# Altium project led-cube.PrjPcb
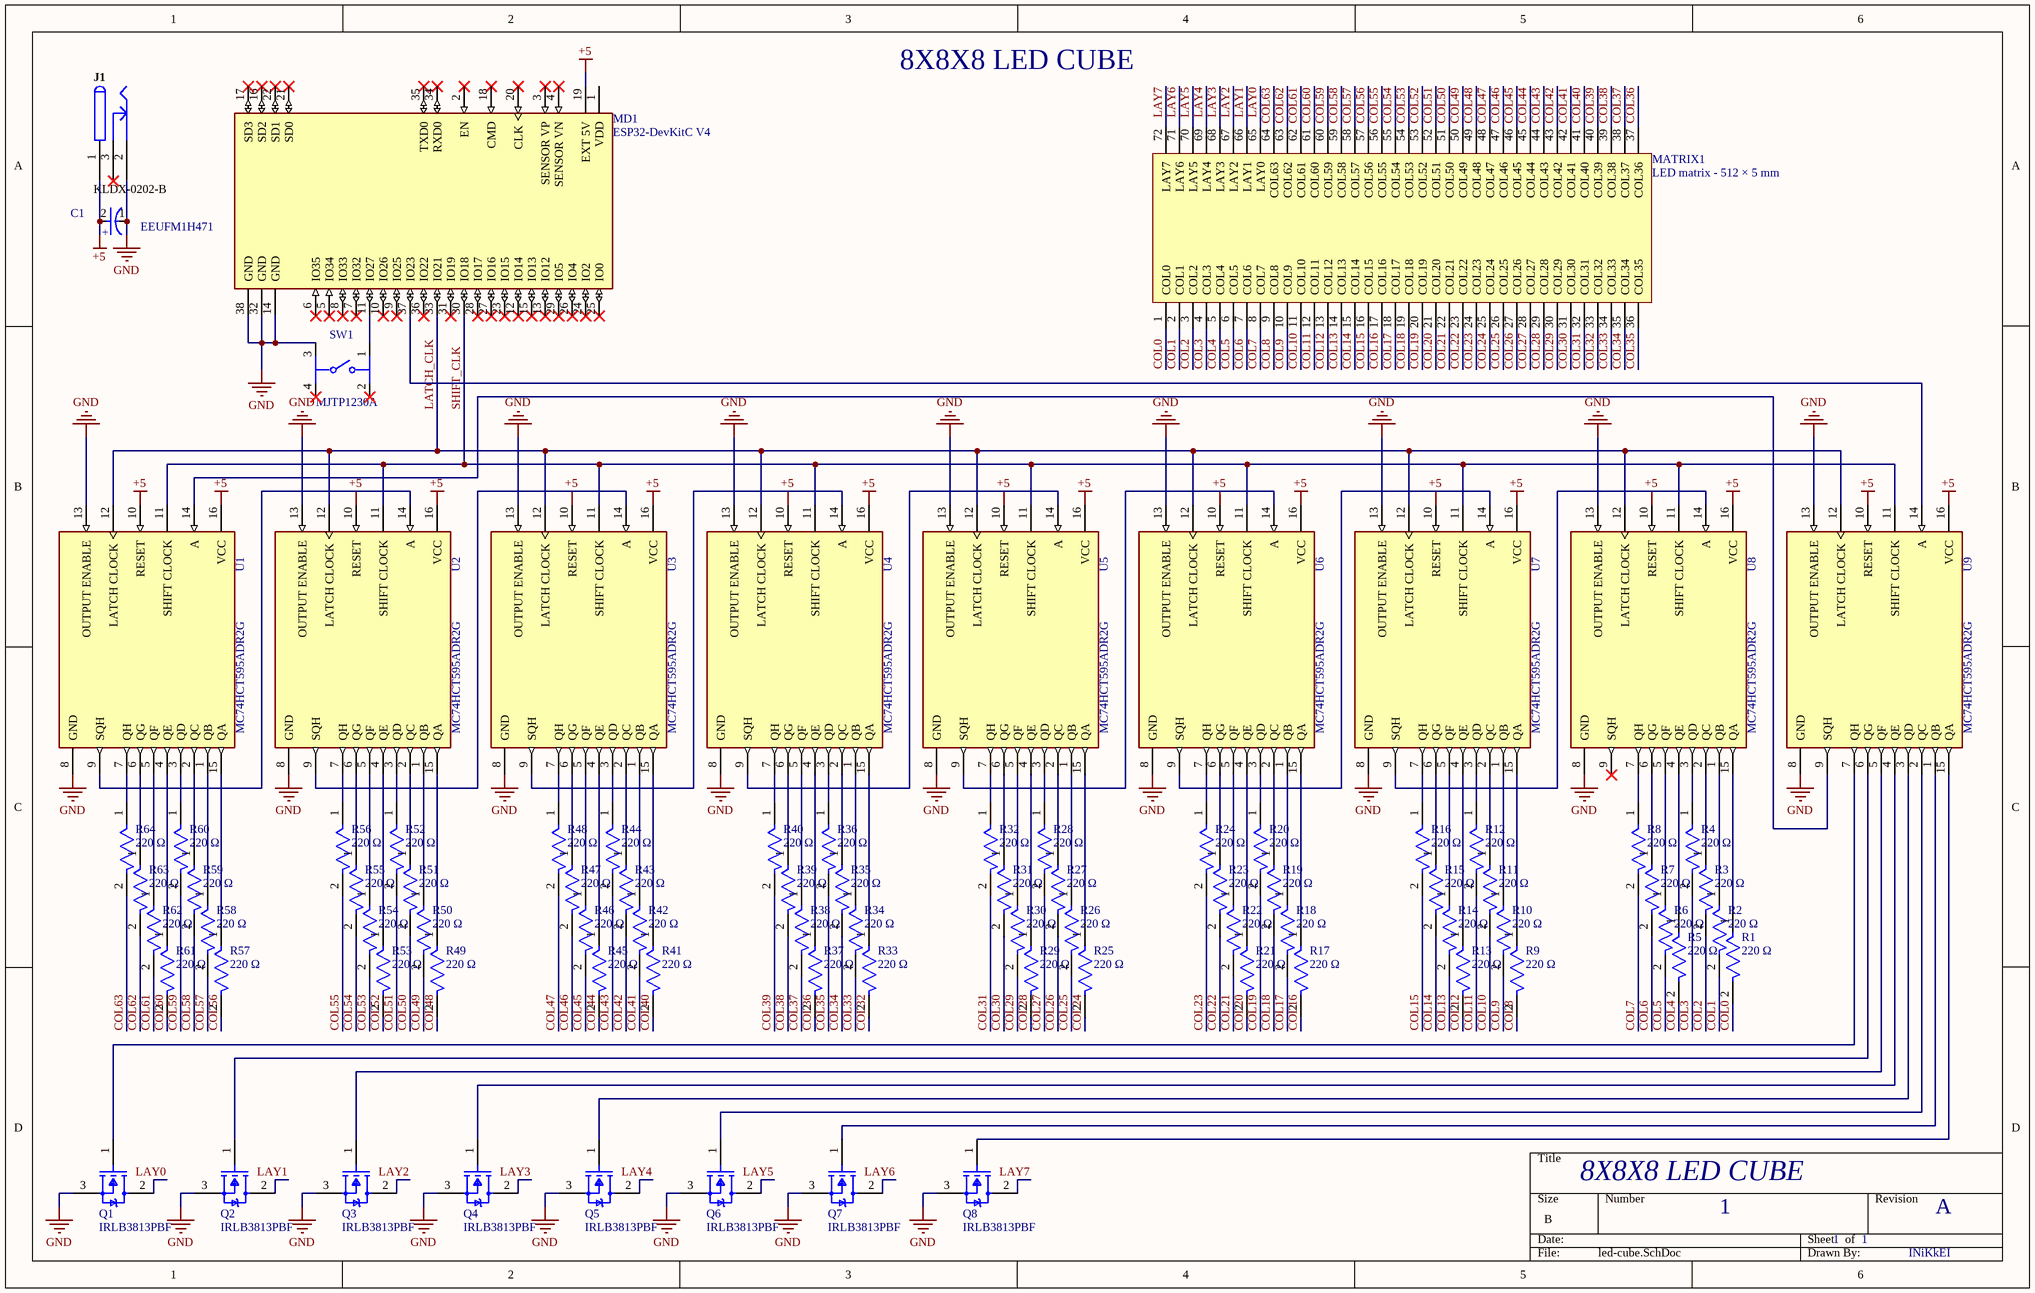
[diagram p0: led-cube.SchDoc]
1 sheet, 86 parts. Net scope: global (net labels, ports and power ports of the same name join across sheets).
Board file: led-cube.PcbDoc

## Sheet led-cube.SchDoc
size B; SheetNumber: 1; SheetTotal: 1

### Parts
C1  EEUFM1H471  [FP-RAD-TH-D_12_5_0_5-L_20-MFG]
J1  KLDX-0202-B  [KYCN-KLDX-0202-B_V]
MATRIX1  LED matrix - 512 × 5 mm  [LED-MATRIX-8x8x8]
MD1  ESP32-DevKitC V4  [FP-ESP32-DevKitC_V4-MFG]
Q1  IRLB3813PBF  [FP-PG-TO220-3-MFG]
Q2  IRLB3813PBF  [FP-PG-TO220-3-MFG]
Q3  IRLB3813PBF  [FP-PG-TO220-3-MFG]
Q4  IRLB3813PBF  [FP-PG-TO220-3-MFG]
Q5  IRLB3813PBF  [FP-PG-TO220-3-MFG]
Q6  IRLB3813PBF  [FP-PG-TO220-3-MFG]
Q7  IRLB3813PBF  [FP-PG-TO220-3-MFG]
Q8  IRLB3813PBF  [FP-PG-TO220-3-MFG]
R1  220 Ω  [FP-MBA0204-MFG]
R2  220 Ω  [FP-MBA0204-MFG]
R3  220 Ω  [FP-MBA0204-MFG]
R4  220 Ω  [FP-MBA0204-MFG]
R5  220 Ω  [FP-MBA0204-MFG]
R6  220 Ω  [FP-MBA0204-MFG]
R7  220 Ω  [FP-MBA0204-MFG]
R8  220 Ω  [FP-MBA0204-MFG]
R9  220 Ω  [FP-MBA0204-MFG]
R10  220 Ω  [FP-MBA0204-MFG]
R11  220 Ω  [FP-MBA0204-MFG]
R12  220 Ω  [FP-MBA0204-MFG]
R13  220 Ω  [FP-MBA0204-MFG]
R14  220 Ω  [FP-MBA0204-MFG]
R15  220 Ω  [FP-MBA0204-MFG]
R16  220 Ω  [FP-MBA0204-MFG]
R17  220 Ω  [FP-MBA0204-MFG]
R18  220 Ω  [FP-MBA0204-MFG]
R19  220 Ω  [FP-MBA0204-MFG]
R20  220 Ω  [FP-MBA0204-MFG]
R21  220 Ω  [FP-MBA0204-MFG]
R22  220 Ω  [FP-MBA0204-MFG]
R23  220 Ω  [FP-MBA0204-MFG]
R24  220 Ω  [FP-MBA0204-MFG]
R25  220 Ω  [FP-MBA0204-MFG]
R26  220 Ω  [FP-MBA0204-MFG]
R27  220 Ω  [FP-MBA0204-MFG]
R28  220 Ω  [FP-MBA0204-MFG]
R29  220 Ω  [FP-MBA0204-MFG]
R30  220 Ω  [FP-MBA0204-MFG]
R31  220 Ω  [FP-MBA0204-MFG]
R32  220 Ω  [FP-MBA0204-MFG]
R33  220 Ω  [FP-MBA0204-MFG]
R34  220 Ω  [FP-MBA0204-MFG]
R35  220 Ω  [FP-MBA0204-MFG]
R36  220 Ω  [FP-MBA0204-MFG]
R37  220 Ω  [FP-MBA0204-MFG]
R38  220 Ω  [FP-MBA0204-MFG]
R39  220 Ω  [FP-MBA0204-MFG]
R40  220 Ω  [FP-MBA0204-MFG]
R41  220 Ω  [FP-MBA0204-MFG]
R42  220 Ω  [FP-MBA0204-MFG]
R43  220 Ω  [FP-MBA0204-MFG]
R44  220 Ω  [FP-MBA0204-MFG]
R45  220 Ω  [FP-MBA0204-MFG]
R46  220 Ω  [FP-MBA0204-MFG]
R47  220 Ω  [FP-MBA0204-MFG]
R48  220 Ω  [FP-MBA0204-MFG]
R49  220 Ω  [FP-MBA0204-MFG]
R50  220 Ω  [FP-MBA0204-MFG]
R51  220 Ω  [FP-MBA0204-MFG]
R52  220 Ω  [FP-MBA0204-MFG]
R53  220 Ω  [FP-MBA0204-MFG]
R54  220 Ω  [FP-MBA0204-MFG]
R55  220 Ω  [FP-MBA0204-MFG]
R56  220 Ω  [FP-MBA0204-MFG]
R57  220 Ω  [FP-MBA0204-MFG]
R58  220 Ω  [FP-MBA0204-MFG]
R59  220 Ω  [FP-MBA0204-MFG]
R60  220 Ω  [FP-MBA0204-MFG]
R61  220 Ω  [FP-MBA0204-MFG]
R62  220 Ω  [FP-MBA0204-MFG]
R63  220 Ω  [FP-MBA0204-MFG]
R64  220 Ω  [FP-MBA0204-MFG]
SW1  MJTP1230A  [FP-MJTP1230A-MFG]
U1  MC74HCT595ADR2G  [FP-751B-05-MFG]
U2  MC74HCT595ADR2G  [FP-751B-05-MFG]
U3  MC74HCT595ADR2G  [FP-751B-05-MFG]
U4  MC74HCT595ADR2G  [FP-751B-05-MFG]
U5  MC74HCT595ADR2G  [FP-751B-05-MFG]
U6  MC74HCT595ADR2G  [FP-751B-05-MFG]
U7  MC74HCT595ADR2G  [FP-751B-05-MFG]
U8  MC74HCT595ADR2G  [FP-751B-05-MFG]
U9  MC74HCT595ADR2G  [FP-751B-05-MFG]

### Nets
+5: C1.2(A) J1.1 MD1.19(EXT_5V) U1.10(RESET) U1.16(VCC) U2.10(RESET) U2.16(VCC) U3.10(RESET) U3.16(VCC) U4.10(RESET) U4.16(VCC) U5.10(RESET) U5.16(VCC) U6.10(RESET) U6.16(VCC) U7.10(RESET) U7.16(VCC) U8.10(RESET) U8.16(VCC) U9.10(RESET) U9.16(VCC)
GND: C1.1(C) J1.2 MD1.14(GND) MD1.32(GND) MD1.38(GND) Q1.3(S) Q2.3(S) Q3.3(S) Q4.3(S) Q5.3(S) Q6.3(S) Q7.3(S) Q8.3(S) SW1.3 U1.8(GND) U1.13(OUTPUT_ENABLE) U2.8(GND) U2.13(OUTPUT_ENABLE) U3.8(GND) U3.13(OUTPUT_ENABLE) U4.8(GND) U4.13(OUTPUT_ENABLE) U5.8(GND) U5.13(OUTPUT_ENABLE) U6.8(GND) U6.13(OUTPUT_ENABLE) U7.8(GND) U7.13(OUTPUT_ENABLE) U8.8(GND) U8.13(OUTPUT_ENABLE) U9.8(GND) U9.13(OUTPUT_ENABLE)
COL0: MATRIX1.1(COL0) R1.2
COL1: MATRIX1.2(COL1) R2.2
COL2: MATRIX1.3(COL2) R3.2
COL3: MATRIX1.4(COL3) R4.2
COL4: MATRIX1.5(COL4) R5.2
COL5: MATRIX1.6(COL5) R6.2
COL6: MATRIX1.7(COL6) R7.2
COL7: MATRIX1.8(COL7) R8.2
COL8: MATRIX1.9(COL8) R9.2
COL9: MATRIX1.10(COL9) R10.2
COL10: MATRIX1.11(COL10) R11.2
COL11: MATRIX1.12(COL11) R12.2
COL12: MATRIX1.13(COL12) R13.2
COL13: MATRIX1.14(COL13) R14.2
COL14: MATRIX1.15(COL14) R15.2
COL15: MATRIX1.16(COL15) R16.2
COL16: MATRIX1.17(COL16) R17.2
COL17: MATRIX1.18(COL17) R18.2
COL18: MATRIX1.19(COL18) R19.2
COL19: MATRIX1.20(COL19) R20.2
COL20: MATRIX1.21(COL20) R21.2
COL21: MATRIX1.22(COL21) R22.2
COL22: MATRIX1.23(COL22) R23.2
COL23: MATRIX1.24(COL23) R24.2
COL24: MATRIX1.25(COL24) R25.2
COL25: MATRIX1.26(COL25) R26.2
COL26: MATRIX1.27(COL26) R27.2
COL27: MATRIX1.28(COL27) R28.2
COL28: MATRIX1.29(COL28) R29.2
COL29: MATRIX1.30(COL29) R30.2
COL30: MATRIX1.31(COL30) R31.2
COL31: MATRIX1.32(COL31) R32.2
COL32: MATRIX1.33(COL32) R33.2
COL33: MATRIX1.34(COL33) R34.2
COL34: MATRIX1.35(COL34) R35.2
COL35: MATRIX1.36(COL35) R36.2
COL36: MATRIX1.37(COL36) R37.2
COL37: MATRIX1.38(COL37) R38.2
COL38: MATRIX1.39(COL38) R39.2
COL39: MATRIX1.40(COL39) R40.2
COL40: MATRIX1.41(COL40) R41.2
COL41: MATRIX1.42(COL41) R42.2
COL42: MATRIX1.43(COL42) R43.2
COL43: MATRIX1.44(COL43) R44.2
COL44: MATRIX1.45(COL44) R45.2
COL45: MATRIX1.46(COL45) R46.2
COL46: MATRIX1.47(COL46) R47.2
COL47: MATRIX1.48(COL47) R48.2
COL48: MATRIX1.49(COL48) R49.2
COL49: MATRIX1.50(COL49) R50.2
COL50: MATRIX1.51(COL50) R51.2
COL51: MATRIX1.52(COL51) R52.2
COL52: MATRIX1.53(COL52) R53.2
COL53: MATRIX1.54(COL53) R54.2
COL54: MATRIX1.55(COL54) R55.2
COL55: MATRIX1.56(COL55) R56.2
COL56: MATRIX1.57(COL56) R57.2
COL57: MATRIX1.58(COL57) R58.2
COL58: MATRIX1.59(COL58) R59.2
COL59: MATRIX1.60(COL59) R60.2
COL60: MATRIX1.61(COL60) R61.2
COL61: MATRIX1.62(COL61) R62.2
COL62: MATRIX1.63(COL62) R63.2
COL63: MATRIX1.64(COL63) R64.2
LATCH_CLK: MD1.33(IO21) U1.12(LATCH_CLOCK) U2.12(LATCH_CLOCK) U3.12(LATCH_CLOCK) U4.12(LATCH_CLOCK) U5.12(LATCH_CLOCK) U6.12(LATCH_CLOCK) U7.12(LATCH_CLOCK) U8.12(LATCH_CLOCK) U9.12(LATCH_CLOCK)
LAY0: MATRIX1.65(LAY0) Q1.2(D)
LAY1: MATRIX1.66(LAY1) Q2.2(D)
LAY2: MATRIX1.67(LAY2) Q3.2(D)
LAY3: MATRIX1.68(LAY3) Q4.2(D)
LAY4: MATRIX1.69(LAY4) Q5.2(D)
LAY5: MATRIX1.70(LAY5) Q6.2(D)
LAY6: MATRIX1.71(LAY6) Q7.2(D)
LAY7: MATRIX1.72(LAY7) Q8.2(D)
SHIFT_CLK: MD1.30(IO18) U1.11(SHIFT_CLOCK) U2.11(SHIFT_CLOCK) U3.11(SHIFT_CLOCK) U4.11(SHIFT_CLOCK) U5.11(SHIFT_CLOCK) U6.11(SHIFT_CLOCK) U7.11(SHIFT_CLOCK) U8.11(SHIFT_CLOCK) U9.11(SHIFT_CLOCK)
NetMD1_11: MD1.11(IO27) SW1.1
NetMD1_37: MD1.37(IO23) U9.14(A)
NetQ1_1: Q1.1(G) U9.7(QH)
NetQ2_1: Q2.1(G) U9.6(QG)
NetQ3_1: Q3.1(G) U9.5(QF)
NetQ4_1: Q4.1(G) U9.4(QE)
NetQ5_1: Q5.1(G) U9.3(QD)
NetQ6_1: Q6.1(G) U9.2(QC)
NetQ7_1: Q7.1(G) U9.1(QB)
NetQ8_1: Q8.1(G) U9.15(QA)
NetR1_1: R1.1 U8.15(QA)
NetR2_1: R2.1 U8.1(QB)
NetR3_1: R3.1 U8.2(QC)
NetR4_1: R4.1 U8.3(QD)
NetR5_1: R5.1 U8.4(QE)
NetR6_1: R6.1 U8.5(QF)
NetR7_1: R7.1 U8.6(QG)
NetR8_1: R8.1 U8.7(QH)
NetR9_1: R9.1 U7.15(QA)
NetR10_1: R10.1 U7.1(QB)
NetR11_1: R11.1 U7.2(QC)
NetR12_1: R12.1 U7.3(QD)
NetR13_1: R13.1 U7.4(QE)
NetR14_1: R14.1 U7.5(QF)
NetR15_1: R15.1 U7.6(QG)
NetR16_1: R16.1 U7.7(QH)
NetR17_1: R17.1 U6.15(QA)
NetR18_1: R18.1 U6.1(QB)
NetR19_1: R19.1 U6.2(QC)
NetR20_1: R20.1 U6.3(QD)
NetR21_1: R21.1 U6.4(QE)
NetR22_1: R22.1 U6.5(QF)
NetR23_1: R23.1 U6.6(QG)
NetR24_1: R24.1 U6.7(QH)
NetR25_1: R25.1 U5.15(QA)
NetR26_1: R26.1 U5.1(QB)
NetR27_1: R27.1 U5.2(QC)
NetR28_1: R28.1 U5.3(QD)
NetR29_1: R29.1 U5.4(QE)
NetR30_1: R30.1 U5.5(QF)
NetR31_1: R31.1 U5.6(QG)
NetR32_1: R32.1 U5.7(QH)
NetR33_1: R33.1 U4.15(QA)
NetR34_1: R34.1 U4.1(QB)
NetR35_1: R35.1 U4.2(QC)
NetR36_1: R36.1 U4.3(QD)
NetR37_1: R37.1 U4.4(QE)
NetR38_1: R38.1 U4.5(QF)
NetR39_1: R39.1 U4.6(QG)
NetR40_1: R40.1 U4.7(QH)
NetR41_1: R41.1 U3.15(QA)
NetR42_1: R42.1 U3.1(QB)
NetR43_1: R43.1 U3.2(QC)
NetR44_1: R44.1 U3.3(QD)
NetR45_1: R45.1 U3.4(QE)
NetR46_1: R46.1 U3.5(QF)
NetR47_1: R47.1 U3.6(QG)
NetR48_1: R48.1 U3.7(QH)
NetR49_1: R49.1 U2.15(QA)
NetR50_1: R50.1 U2.1(QB)
NetR51_1: R51.1 U2.2(QC)
NetR52_1: R52.1 U2.3(QD)
NetR53_1: R53.1 U2.4(QE)
NetR54_1: R54.1 U2.5(QF)
NetR55_1: R55.1 U2.6(QG)
NetR56_1: R56.1 U2.7(QH)
NetR57_1: R57.1 U1.15(QA)
NetR58_1: R58.1 U1.1(QB)
NetR59_1: R59.1 U1.2(QC)
NetR60_1: R60.1 U1.3(QD)
NetR61_1: R61.1 U1.4(QE)
NetR62_1: R62.1 U1.5(QF)
NetR63_1: R63.1 U1.6(QG)
NetR64_1: R64.1 U1.7(QH)
NetU1_9: U1.9(SQH) U2.14(A)
NetU1_14: U1.14(A) U9.9(SQH)
NetU2_9: U2.9(SQH) U3.14(A)
NetU3_9: U3.9(SQH) U4.14(A)
NetU4_9: U4.9(SQH) U5.14(A)
NetU5_9: U5.9(SQH) U6.14(A)
NetU6_9: U6.9(SQH) U7.14(A)
NetU7_9: U7.9(SQH) U8.14(A)

Not connected (* = marked no-connect by the designer): J1 3*; MD1 1(VDD) 2(EN)* 3(SENSOR_VP)* 4(SENSOR_VN)* 5(IO34)* 6(IO35)* 7(IO32)* 8(IO33)* 9(IO25)* 10(IO26)* 12(IO14)* 13(IO12)* 15(IO13)* 16(SD2)* 17(SD3)* 18(CMD)* 20(CLK)* 21(SD0)* 22(SD1)* 23(IO15)* 24(IO2)* 25(IO0)* 26(IO4)* 27(IO16)* 28(IO17)* 29(IO5)* 31(IO19)* 34(RXD0)* 35(TXD0)* 36(IO22)*; SW1 2* 4*; U8 9(SQH)*

### Notes on the sheet
- 8X8X8 LED CUBE
- 1
- A
- INiKkEI
- (in symbol CMP-05427-000073-2) +

### Library data of the parts
C1 = CMP-05427-000073-2: Aluminum Electrolytic Capacitors (Radial Lead Type) 470uF ±20% 50V; Lead Diameter: 0.6mm; ESR (Equivalent Series Resistance): 22mR; Life (Hours): 5000Hour; Ripple Current: 2.26A; Dielectric Material: Aluminium; Lead Length: 17mm; Max Operating Temperature: 105°C; Radiation Hardening: No; Diameter: 12.5mm; Length: 20mm; Termination: Radial; Voltage Rating (DC): 50V; Series: FM; Lead Pitch: 5mm; RoHS Compliant: Yes; Min Operating Temperature: -40°C; Case/Package: Radial; REACH SVHC: No SVHC; Mount: Through Hole; Tolerance: 20%; Height - Seated (Max): 0.787inch; Voltage Rating: 50V; Package Quantity: 200; Packaging: Bulk; Contact Plating: Tin; Voltage: 50V; Features: General Purpose; Height: 20mm; Capacitance: 470uF; Construction: RADIAL; Impedance: 22mR; Lead Free: Lead Free
J1 = CMP-0256-00001-1: 3 Conductor Power Jack, 2 break 2 aux contacts; ComponentLink2URL: http://anacapa.kycon.com/Catalog_PDF/KLDX_0202.pdf; PackageReference: KLDX-0202-B; Contact Finish: Brass; ComponentLink2Description: Datasheet; Mounting Technology: Through Hole; PackageDescription: Jack, 9 x 14.5 mm Body, 2.5 mm Center Pin Diameter; ComponentLink1Description: Manufacturer URL; PartNumber: KLDX-0202-B; ComponentLink1URL: http://kycon.com/
MATRIX1 = LED-MATRIX: LED matrix - 512 × 5 mm - 8x8x8
MD1 = CMP-194065-000004-1: WiFi Development Tools (802.11) ESP32 General Development Kit, ESP32-WROOM-32 on the board; Manufacturer: Espressif; Number Of Adc Channels: 16; Max Supply Voltage: 5V; Bandwidth: 2.4-2.5GHz; Interface: I2C,SPI,UART,I2S; Max Frequency: 2.5GHz; Min Supply Voltage: 2.7V; Number Of Gpio: 22; Package: ESP32-DevKitC V4; Device Class L2: RF Semiconductors and Devices; Device Class L3: Transceivers; ComponentLink2Description: Datasheet; Temperature Range Low: -40°C; ComponentLink2URL: https://docs.espressif.com/projects/esp-idf/en/latest/get-started/get-started-devkitc.html; RoHS: TRUE; Category: UNK; Automotive: No; Device Class L1: Integrated Circuits (ICs); Manufacturer Part Number: ESP32-DevKitC V4; Octopart: https://octopart.com/esp32-devkitc+v4-espressif+systems-107467262; Lead Free: Yes; Temperature: -40°C to
Q1-Q8 = CMP-32901-000118-1: MOSFET N-CH 30V 260A TO-220AB; Manufacturer: Infineon; Threshold Vgs Max: 2.35V; Gate To Source Voltage: 20V; Number Of N Channels: 1; Threshold Vgs Min: 1.35V; Gate Charge At Vgs: 57nC @ 4.5V; Depletion Mode: False; Max Junction Temp: +175°C; Standoff Height: 3.37mm; Input Capacitace At Vds: 8420pF @ 15V; Reverse Recovery Charge: 22nC; Drain To Source Resistance: 2mΩ; Reverse Recovery Time: 24ns; Pulse Drain Current: 1050A; Turn Off Delay Time: 33ns; Turn On Delay Time: 36ns; Rthja Max: 62°C/W; Max Forward Diode Voltage: 1V; Power Dissipation: 230W; Digikey Description: MOSFET N-CH 30V 260A TO-220AB; Device Class L2: Transistors; Device Class L3: MOSFETs; Device Class L1: Discrete Semiconductors; Footprint Url: https://www.infineon.com/dgdl/po-to220ab-fp.pdf?fileId=5546d462580663ef0158068cfbee01be; ComponentLink2Description: Datasheet; Continuous Drain Current: 260A; Drain To Source Voltage: 30V; Temperature: -55°C to +175°C; Temperature Range Low: -55°C; Octopart: https://octopart.com/irlb3813pbf-infineon-65874923; Number Of Channels: 1; Drain To Source Breakdown Voltage: 30V; Height: 19.8mm; Temperature Range High: +175°C; RoHS: TRUE; Automotive: No; Category: Trans; ComponentLink2URL: https://www.infineon.com/dgdl/irlb3813pbf.pdf?fileId=5546d462533600a4015356603cfe258b; Manufacturer Part Number: IRLB3813PBF; Package: PG-TO220-3; Lead Free: Yes
R1-R64 = CMP-02408-000005-1: RES 220 OHM 0.4W 1% AXIAL; Manufacturer Part Number: MBA02040C2200FC100; Manufacturer: Vishay BC Components; Automotive Grade: Grade 1; Value: 220Ω; Voltage Rating: 200V; Temperature Coefficient: 50ppm/°C; Power Rating: 0.25W; Digikey Description: RES 220 OHM 0.4W 1% AXIAL; Height: 1.6mm; Automotive: Yes; Lead Free: Yes; Mouser Description: Thin Film Resistors - Through Hole .4watt 220ohms 1% 1/8watt body size; Temperature Range Low: -55°C; ComponentLink2Description: Datasheet; Temperature: -55°C to +125°C; Device Class L3: Through-Hole Resistors; Ipc Land Pattern Name: RESAD500W65L360D160; Octopart: https://octopart.com/mba02040c2200fc100-vishay-43743094; Series: MBA/SMA 0204; RoHS: TRUE; Tolerance: 1%; Package: MBA0204; Device Class L1: Passive Components; ComponentLink2URL: http://www.vishay.com/docs/28766/mbxsma.pdf; Category: Res; Composition: Metal Film; Device Class L2: Resistors; Temperature Range High: +125°C; Resistance: 220Ω
SW1 = CMP-47024-000004-1: SWITCH TACTILE SPST-NO 0.05A 12V; Mechanical Life: 100000Cycles; Throw Configuration: SPST; Actuator Length: 1.4mm; Switch Travel: 0.25mm; Actuator Color: Black; Operating Force: 160gf; Contact Resistance: 100mR; Actuator Type: Standard; Switch Function: Off-Mom; Actuator Material: Thermoplastic; Illumination Type: Non-Illuminated; Current Rating: 50mA; Min Operating Temperature: -20°C; Series: MJTP; Electrical Life: 100000Cycles; Mount: Through Hole; Packaging: Bulk; Color: Black; Package Quantity: 2000; Voltage Rating (DC): 12V; REACH SVHC: No SVHC; Orientation: Straight; Termination: PC Pin; Contact Material: Bronze; RoHS Compliant: Yes; Max Voltage Rating (DC): 12V; Max Operating Temperature: 70°C; Contact Plating: Silver
U1-U9 = CMP-00278-20374953-1: MC74HCT595ADR2G Shift Register Single 8-Bit Serial to Serial/Parallel 16-Pin SOIC T/R - Tape and Reel; Manufacturer Lifecycle Status: ACTIVE; Number of Bits: 8; Turn-On Delay Time: 45ns; Number of Elements: 1; Operating Supply Voltage: 5V; Propagation Delay: 38ns; Direction: Unidirectional; Max Supply Voltage: 5.5V; Min Supply Voltage: 4.5V; Quiescent Current: 4µA; Lifecycle Status: Production; Case/Package: SOIC; Number of Bits per Element: 8; Logic Function: Shift Register; Lead Free: Lead Free; Packaging: Tape & Reel (TR); Number of Circuits: 1; Max Operating Temperature: 125°C; Halogen Free: Halogen Free; Number of Pins: 16; NexarPartId: 20374953; Schedule B: 8542390000, 8542390000; Contact Plating: Tin; RoHS: Compliant; Mount: Surface Mount; Min Operating Temperature: -55°C